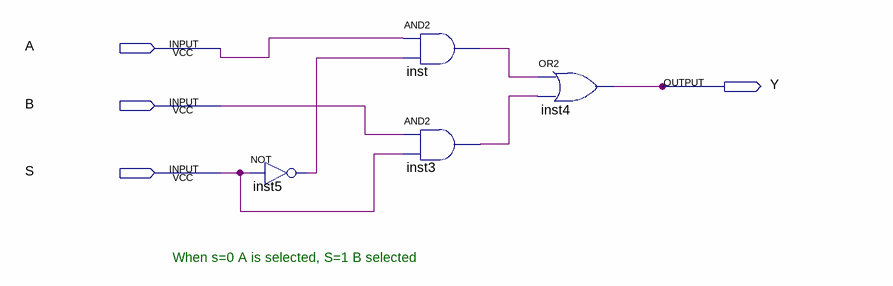
[diagram p0: schematic sheet]
// Quartus schematic Selector21.bdf as structural Verilog: 4 symbols, 4 pins
module Selector21 (
  input  A,
  input  B,
  input  S,
  output Y
);

  wire inst3_out, inst5_out, inst_out;

  not inst5 (inst5_out, S);
  and inst (inst_out, A, inst5_out);
  and inst3 (inst3_out, B, S);
  or inst4 (Y, inst_out, inst3_out);

  // Notes on the sheet:
  //   When s=0 A is selected, S=1 B selected
endmodule
